# Altium project capstone_v1.1.PrjPcb
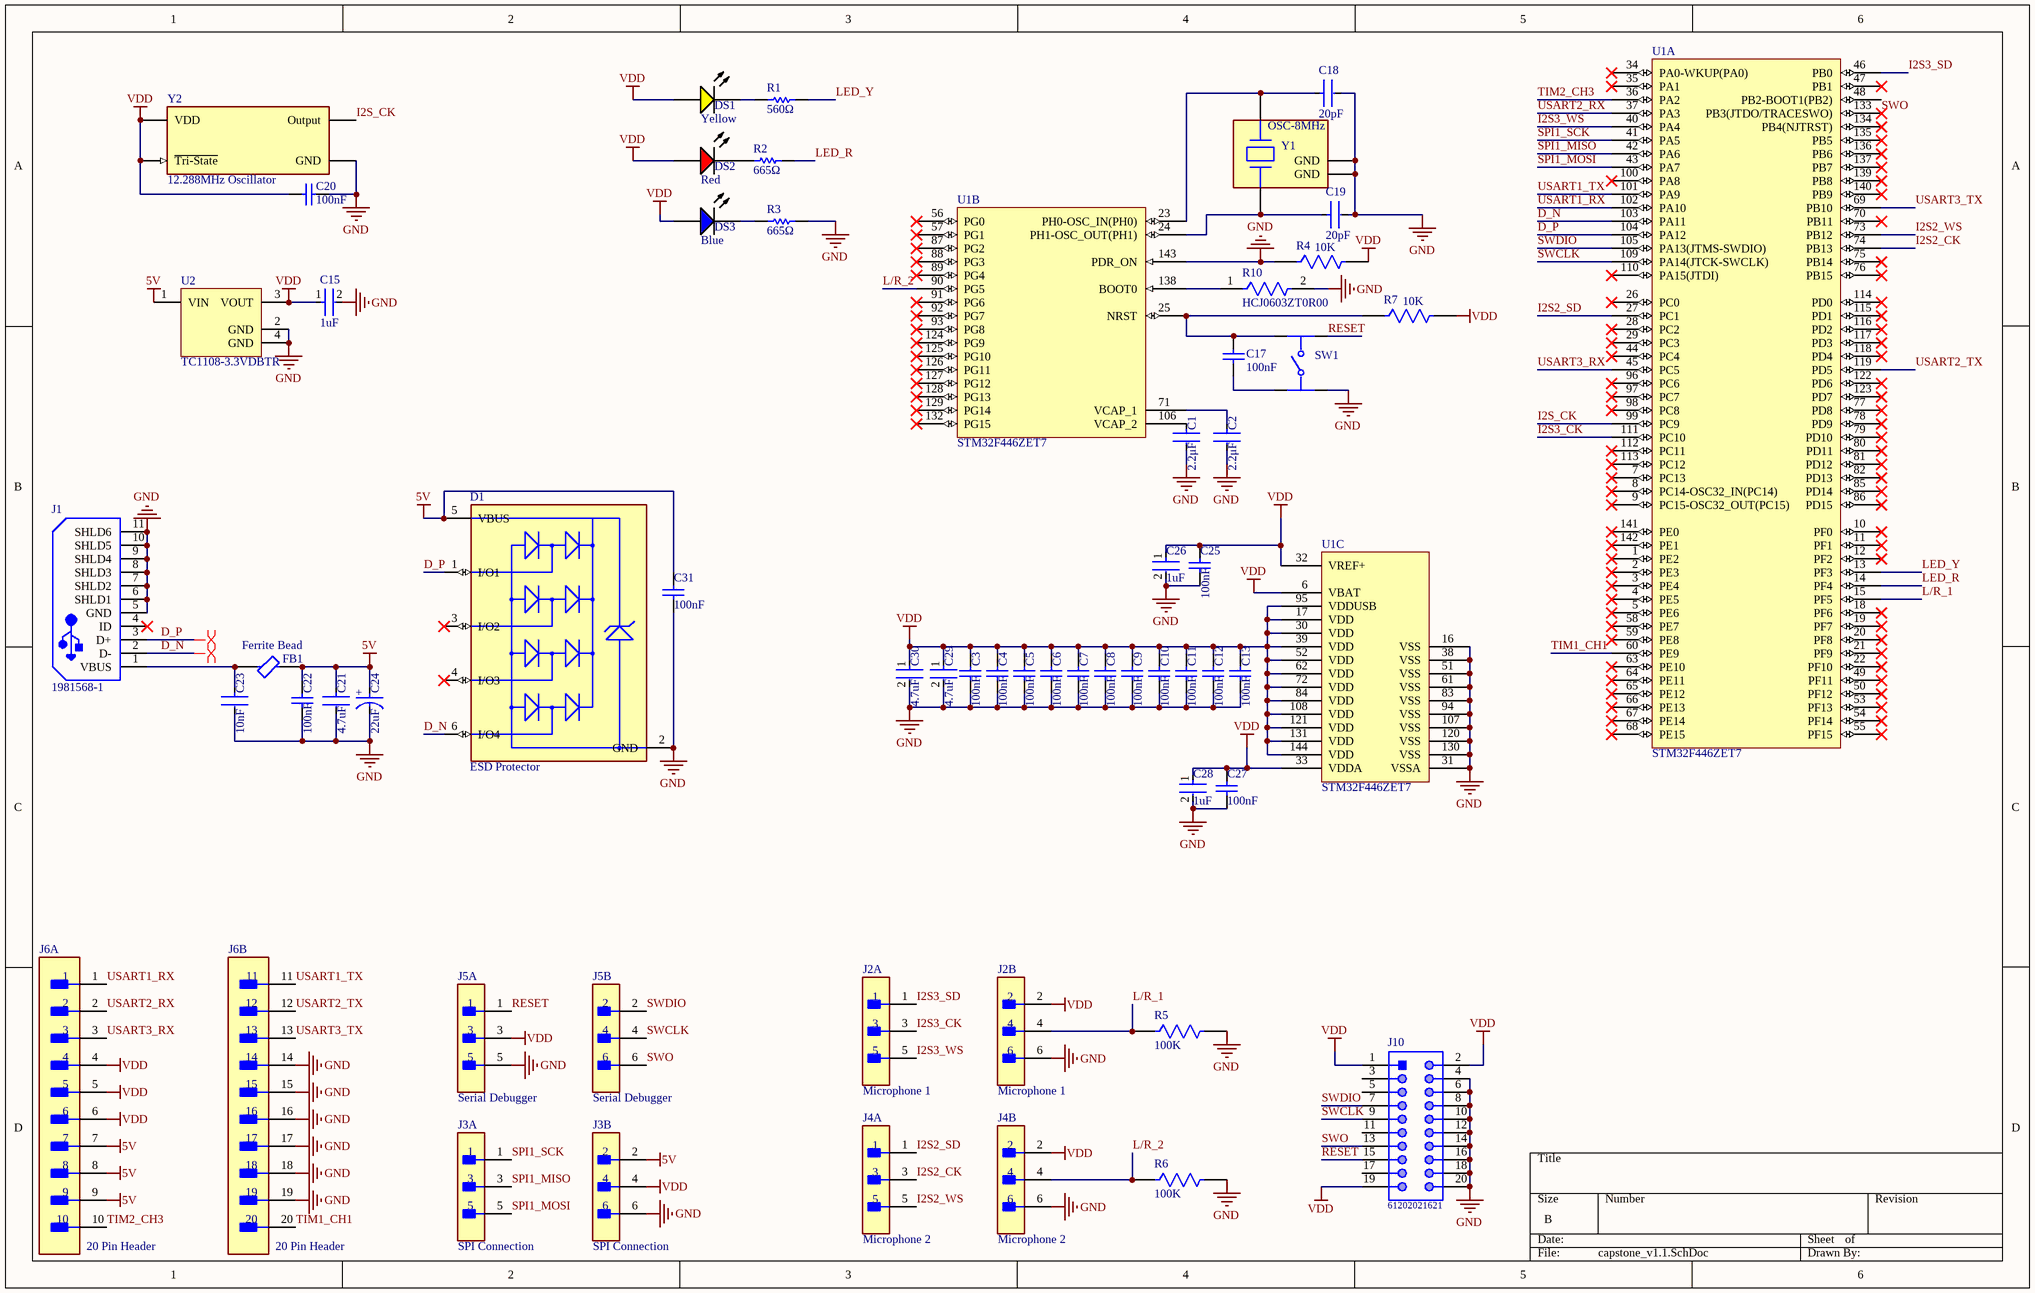
[diagram p0: capstone_v1.1.SchDoc]
1 sheet, 54 parts. Net scope: global (net labels, ports and power ports of the same name join across sheets).
Board file: PCB1.PcbDoc

## Sheet capstone_v1.1.SchDoc
size B; SheetNumber: 1; SheetTotal: 1

### Parts
C1  2.2μF  [FP-C1608-080-0_1-MFG]
C2  2.2μF  [FP-C1608-080-0_1-MFG]
C3  100nF  [SAMS-C0603-2_M]
C4  100nF  [SAMS-C0603-2_M]
C5  100nF  [SAMS-C0603-2_M]
C6  100nF  [SAMS-C0603-2_M]
C7  100nF  [SAMS-C0603-2_M]
C8  100nF  [SAMS-C0603-2_M]
C9  100nF  [SAMS-C0603-2_M]
C10  100nF  [SAMS-C0603-2_M]
C11  100nF  [SAMS-C0603-2_M]
C12  100nF  [SAMS-C0603-2_M]
C13  100nF  [SAMS-C0603-2_M]
C15  1uF  [FP-0603-L_1_6_0_15-W_0_81-IPC_A]
C17  100nF  [SAMS-C0603-2_M]
C18  20pF  [FP-C0603C-CF-MFG]
C19  20pF  [FP-C0603C-CF-MFG]
C20  100nF  [SAMS-C0603-2_M]
C21  4.7uF  [FP-C0603-CG-MFG]
C22  100nF  [SAMS-C0603-2_M]
C23  10nF  [FP-0603-L_1_6_0_15-W_0_81-MFG]
C24  22uF  [FP-T491C226K010AT-MFG]
C25  100nF  [SAMS-C0603-2_M]
C26  1uF  [FP-0603-L_1_6_0_15-W_0_81-IPC_A]
C27  100nF  [SAMS-C0603-2_M]
C28  1uF  [FP-0603-L_1_6_0_15-W_0_81-IPC_A]
C29  4.7uF  [FP-C0603-CG-MFG]
C30  4.7uF  [FP-C0603-CG-MFG]
C31  100nF  [SAMS-C0603-2_M]
D1  ESD Protector  [FP-SOT23-6L-MFG]
DS1  Yellow  [VISH-TLMY1000_V]
DS2  Red  [AVAG-HSMX-C190_V]
DS3  Blue  [AVAG-HSMX-C190_V]
FB1  Ferrite Bead  [FP-BLM15-0_05-IPC_A]
J1  1981568-1  [TECO-1981568-5_V]
J2  Microphone 1  [FP-M20-9980346-MFG]  (parts A,B of 2)
J3  SPI Connection  [FP-M20-9980346-MFG]  (parts A,B of 2)
J4  Microphone 2  [FP-M20-9980346-MFG]  (parts A,B of 2)
J5  Serial Debugger  [FP-M20-9980346-MFG]  (parts A,B of 2)
J6  20 Pin Header  [FP-TSW-110-08-G-D-MFG]  (parts A,B of 2)
J10  61202021621  [61202021621]
R1  560Ω  [RESC1608X55X30ML15T15]
R2  665Ω  [RESC1608X55X30ML15T15]
R3  665Ω  [RESC1608X55X30ML15T15]
R4  10K  [FP-MCT0603-IPC_C]
R5  100K  [FP-RC0603-0_55-MFG]
R6  100K  [FP-RC0603-0_55-MFG]
R7  10K  [FP-MCT0603-IPC_C]
R10  HCJ0603ZT0R00  [FP-HCJ0603-MFG]
SW1  PTS645SM43SMTR92LFS  [FP-PTS645SM43SMTR92LFS-MFG]  (value not drawn)
U1  STM32F446ZET7  [STM-LQFP144_M]  (parts A,B,C of 3)
U2  TC1108-3.3VDBTR  [SOT-223-DB3_L]
Y1  OSC-8MHz  [FP-ABM3B-MFG]
Y2  12.288MHz Oscillator  [FP-ASFL1-MFG]

### Nets
5V: C21.1 C22.2 C24.2(A) C31.2 D1.5(VBUS) FB1.2 J3.2 J6.7 J6.8 J6.9 U2.1(VIN)
GND: C1.1 C2.1 C3.1 C4.1 C5.1 C6.1 C7.1 C8.1 C9.1 C10.1 C11.1 C12.1 C13.1 C15.2 C18.2 C19.2 C20.1 C21.2 C22.1 C23.2 C24.1(C) C25.1 C26.2 C27.1 C28.2 C29.2 C30.2 C31.1 D1.2(GND) J1.5(GND) J1.6(SHLD1) J1.7(SHLD2) J1.8(SHLD3) J1.9(SHLD4) J1.10(SHLD5) J1.11(SHLD6) J2.6 J3.6 J4.6 J5.5 J6.14 J6.15 J6.16 J6.17 J6.18 J6.19 J10.4 J10.6 J10.8 J10.10 J10.12 J10.14 J10.16 J10.18 J10.20 R3.2 R4.1 R5.2 R6.2 R10.2 SW1.4 U1.16(VSS) U1.31(VSSA) U1.38(VSS) U1.51(VSS) U1.61(VSS) U1.83(VSS) U1.94(VSS) U1.107(VSS) U1.120(VSS) U1.130(VSS) U1.143(PDR_ON) U2.2(GND) U2.4(GND) Y1.2(GND) Y1.4(GND) Y2.2(GND)
VDD: C3.2 C4.2 C5.2 C6.2 C7.2 C8.2 C9.2 C10.2 C11.2 C12.2 C13.2 C15.1 C20.2 C25.2 C26.1 C27.2 C28.1 C29.1 C30.1 DS1.1(A) DS2.1(A) DS3.1(A) J2.2 J3.4 J4.2 J5.3 J6.4 J6.5 J6.6 J10.1 J10.2 J10.19 R4.2 R7.2 U1.6(VBAT) U1.17(VDD) U1.30(VDD) U1.32(VREF+) U1.33(VDDA) U1.39(VDD) U1.52(VDD) U1.62(VDD) U1.72(VDD) U1.84(VDD) U1.95(VDDUSB) U1.108(VDD) U1.121(VDD) U1.131(VDD) U1.144(VDD) U2.3(VOUT) Y2.1(~{Tri-State}) Y2.4(VDD)
D_N: D1.6(I/O4) J1.2(D-) U1.103(PA11)
D_P: D1.1(I/O1) J1.3(D+) U1.104(PA12)
I2S2_CK: J4.3 U1.74(PB13)
I2S2_SD: J4.1 U1.27(PC1)
I2S2_WS: J4.5 U1.73(PB12)
I2S3_CK: J2.3 U1.111(PC10)
I2S3_SD: J2.1 U1.46(PB0)
I2S3_WS: J2.5 U1.40(PA4)
I2S_CK: U1.99(PC9) Y2.3(Output)
L/R_1: J2.4 R5.1 U1.15(PF5)
L/R_2: J4.4 R6.1 U1.90(PG5)
LED_R: R2.2 U1.14(PF4)
LED_Y: R1.2 U1.13(PF3)
RESET: J5.1 J10.15 SW1.2
SPI1_MISO: J3.3 U1.42(PA6)
SPI1_MOSI: J3.5 U1.43(PA7)
SPI1_SCK: J3.1 U1.41(PA5)
SWCLK: J5.4 J10.9 U1.109(PA14(JTCK-SWCLK))
SWDIO: J5.2 J10.7 U1.105(PA13(JTMS-SWDIO))
SWO: J5.6 J10.13 U1.133(PB3(JTDO/TRACESWO))
TIM1_CH1: J6.20 U1.60(PE9)
TIM2_CH3: J6.10 U1.36(PA2)
USART1_RX: J6.1 U1.102(PA10)
USART1_TX: J6.11 U1.101(PA9)
USART2_RX: J6.2 U1.37(PA3)
USART2_TX: J6.12 U1.119(PD5)
USART3_RX: J6.3 U1.45(PC5)
USART3_TX: J6.13 U1.69(PB10)
NetC1_2: C1.2 U1.106(VCAP_2)
NetC2_2: C2.2 U1.71(VCAP_1)
NetC17_1: C17.1 SW1.3
NetC17_2: C17.2 R7.1 SW1.1 U1.25(NRST)
NetC18_1: C18.1 U1.23(PH0-OSC_IN(PH0)) Y1.1
NetC19_1: C19.1 U1.24(PH1-OSC_OUT(PH1)) Y1.3
NetC23_1: C23.1 FB1.1 J1.1(VBUS)
NetDS1_2: DS1.2(K) R1.1
NetDS2_2: DS2.2(K) R2.1
NetDS3_2: DS3.2(K) R3.1
NetR10_1: R10.1 U1.138(BOOT0)

Not connected (* = marked no-connect by the designer): D1 3(I/O2)* 4(I/O3)*; J1 4(ID)*; J10 3 5 11 17; U1 1(PE2)* 2(PE3)* 3(PE4)* 4(PE5)* 5(PE6)* 7(PC13)* 8(PC14-OSC32_IN(PC14))* 9(PC15-OSC32_OUT(PC15))* 10(PF0)* 11(PF1)* 12(PF2)* 18(PF6)* 19(PF7)* 20(PF8)* 21(PF9)* 22(PF10)* 26(PC0)* 28(PC2)* 29(PC3)* 34(PA0-WKUP(PA0))* 35(PA1)* 44(PC4)* 47(PB1)* 48(PB2-BOOT1(PB2)) 49(PF11)* 50(PF12)* 53(PF13)* 54(PF14)* 55(PF15)* 56(PG0)* 57(PG1)* 58(PE7)* 59(PE8)* 63(PE10)* 64(PE11)* 65(PE12)* 66(PE13)* 67(PE14)* 68(PE15)* 70(PB11)* 75(PB14)* 76(PB15)* 77(PD8)* 78(PD9)* 79(PD10)* 80(PD11)* 81(PD12)* 82(PD13)* 85(PD14)* 86(PD15)* 87(PG2)* 88(PG3)* 89(PG4)* 91(PG6)* 92(PG7)* 93(PG8)* 96(PC6)* 97(PC7)* 98(PC8)* 100(PA8)* 110(PA15(JTDI))* 112(PC11)* 113(PC12)* 114(PD0)* 115(PD1)* 116(PD2)* 117(PD3)* 118(PD4)* 122(PD6)* 123(PD7)* 124(PG9)* 125(PG10)* 126(PG11)* 127(PG12)* 128(PG13)* 129(PG14)* 132(PG15)* 134(PB4(NJTRST))* 135(PB5)* 136(PB6)* 137(PB7)* 139(PB8)* 140(PB9)* 141(PE0)* 142(PE1)*

### Layout directives
differential pair: D_N, D_P

### Notes on the sheet
- (in symbol CMP-03017-000041-1) +

### Library data of the parts
C1 C2 = CMP-08246-004960-1: Multilayer Ceramic Capacitors 2.2μF ±10% 35V X5R SMD 0603 / C1608X5R1V225K080AC; Capacitance: 2.2uF; Dielectric Material: Ceramic; Length: 1.6mm; Height: 0.8mm; Package Quantity: 1; Width: 0.031inch; Radiation Hardening: No; Lead Free: Lead Free; Mount: Surface Mount; REACH SVHC: No SVHC; Construction: Flat; Voltage Rating (DC): 35V; Voltage Rating: 35V; Case/Package: 0603; Termination: SMD/SMT; Dielectric: X5R; Resistor Type: Ceramic; Thickness: 800um; Tolerance: 10%; Case Code (Metric): 1608; Case Code (Imperial): 0603; Weight: 7.1E-05oz; RoHS Compliant: Yes; Min Operating Temperature: -55°C; Series: C; Max Operating Temperature: 85°C; Depth: 0.8mm; Voltage: 35V; Packaging: Tape and Reel
C3-C13 C17 C20 C22 C25 C27 C31 = CMP-2000-05332-1: Multi-layer Ceramic Capacitor, -55 to 125 degC, 2-Pin SMD (0603), RoHS, Tape and Reel / CL10B104KB8NNNC; Manufacturer: Samsung Electro-Mechanics; Capacitance: 0.1µF; Rated Voltage: 50V; Dielectric: X7R; Tolerance (%): ±10%; Case Size/Dimension: 0603; Datasheet URL: https://datasheet.ciiva.com/29198/456651-da-01-en-vs-kondensator-0605-29198839.pdf; Manufacturer URL: http://www.samsungsem.com/global/index.jsp; Datasheet Version: Nov-10
C15 C26 C28 = CMP-2006-04559-3: General Purpose Ceramic Capacitor, 0603, 1uF, 10%, X5R, 15%, 10V / 0603ZD105KAT2A; Insulation Resistance: 100GR; Dissipation Factor: 5%; Packaging: Tape and Reel; RoHS Compliant: Yes; Height: 0.9mm; Tolerance: 10%; Length: 1.6mm; Depth: 0.81mm; Case/Package: 0603; Max Operating Temperature: 85°C; Series: -; Dielectric: X5R; Construction: Flat; Capacitance: 1uF; REACH SVHC: No SVHC; Voltage Rating: 10V; Number of Pins: 2; Radiation Hardening: No; Case Code (Imperial): 0603; Min Operating Temperature: -55°C; Termination: SMD/SMT; Contact Plating: Tin; Voltage: 10V; Thickness: 0.035inch; Lead Free: Lead Free; Mount: Surface Mount; Width: 0.81mm; Voltage Rating (DC): 10V; Package Quantity: 4000; Case Code (Metric): 1608
C18 C19 = CMP-1035-00783-3: CAP CER 20PF 50V 5% NP0 0603 / C0603C200J5GACTU; Manufacturer: KEMET; Temperature Coefficient: 30ppm/°C; Temperature Characteristic: C0G; Automotive Grade: Grade 1; Tolerance: 0.05; Material: Ceramic; Category: Cap; Manufacturer Part Number: C0603C200J5GACTU; Temperature Range Low: -55°C; RoHS: TRUE; ComponentLink2URL: https://api.kemet.com/component-edge/download/datasheet/C0603C100J5GACAUTO.pdf; Package: C0603C-CF; Height: 0.87mm; Capacitance: 20 pF; Voltage Rating: 50 V; Octopart: https://octopart.com/c0603c200j5gactu-kemet-9138585; Device Class L1: Passive Components; Automotive: Yes; Digikey Description: CAP CER 20PF 50V 5% NP0 0603; Temperature Range High: +125°C; Device Class L3: Ceramic Capacitors; Mouser Description: Multilayer Ceramic Capacitors MLCC - SMD/SMT 50volts 20pF C0G 5%; ComponentLink2Description: Datasheet; Device Class L2: Capacitors; Lead Free: Yes; Temperature: -55°C to +125°C; Value: 20 pF
C21 C29 C30 = CMP-2006-02256-2: CAP CER 4.7UF 6.3V X5R 0603 / C0603C475K9PACTU; Manufacturer: Kemet; Temperature Coefficient: 15%; Tolerance: 10%; Material: Ceramic; Device Class L3: Ceramic Capacitors; RoHS: TRUE; Value: 4.7uF; Lead Free: Yes; ComponentLink2Description: Datasheet; Mouser Description: Multilayer Ceramic Capacitors MLCC - SMD/SMT 6.3volts 4.7uF X5R 10%; Package: C0603-CG; Digikey Description: CAP CER 4.7UF 6.3V X5R 0603; ComponentLink2URL: https://content.kemet.com/datasheets/KEM_C1006_X5R_SMD.pdf; Category: Cap; Temperature Range Low: -55°C; Capacitance: 4.7uF; Temperature: -55°C to +85°C; Octopart: https://octopart.com/c0603c475k9pactu-kemet-104242; Ipc Land Pattern Name: CAPC16080X80; Voltage Rating: 6.3V; Temperature Range High: +85°C; Height: 0.9mm; Temperature Characteristic: X5R; Device Class L1: Passive Components; Manufacturer Part Number: C0603C475K9PACTU; Automotive: No; Device Class L2: Capacitors
C23 = CMP-2006-04374-2: General Purpose Ceramic Capacitor, 0603, 10nF, 10%, X7R, 15%, 50V; Insulation Resistance: 100GR; Dissipation Factor: 2.5%; Voltage: 50V; Number of Pins: 2; Min Operating Temperature: -55°C; Mount: Surface Mount; Capacitance: 10nF; Width: 0.032inch; Height: 0.9mm; Voltage Rating: 50V; Termination: SMD/SMT; Package Quantity: 1; Dielectric: X7R; Max Operating Temperature: 125°C; Contact Plating: Tin; Length: 1.6mm; Dielectric Material: Ceramic; REACH SVHC: No SVHC; Case Code (Imperial): 0603; Depth: 0.81mm; Thickness: 0.035inch; Packaging: Tape and Reel; Tolerance: 10%; Lead Free: Lead Free; Voltage Rating (DC): 50V; Radiation Hardening: No; Case/Package: 0603; Case Code (Metric): 1608
C24 = CMP-03017-000041-1: CAP TANT 22UF 10% 10V 2312 / T491C226K010AT; Polarity: Polar; Leakage Current: 2.2uA; Tolerance: 20%; Life (Hours): 2000Hour; Dissipation Factor: 6%; ESR (Equivalent Series Resistance): 1.8R; Dielectric Material: Tantalum; Packaging: Tape and Reel; Termination: SMD/SMT; Length: 6mm; Voltage Rating (DC): 10V; Series: T491; Case/Package: Molded; Lead Free: Lead Free; Mount: Surface Mount; RoHS Compliant: Yes; Number of Pins: 2; Voltage Rating: 10V; Case Code (Imperial): 2312; Width: 3.2mm; Case Code (Metric): 6032; Voltage: 10V; Depth: 3.2mm; Features: General Purpose; Height - Seated (Max): 0.11inch; Capacitance: 22uF; Size: 2.5mm; Max Operating Temperature: 125°C; Construction: Flat; REACH SVHC: No SVHC; Package Quantity: 1; Min Operating Temperature: -55°C; Radiation Hardening: No; Height: 2.5mm
D1 = CMP-2000-07370-2: TVS DIODE 5.25V 17V SOT23-6 / USBLC6-4SC6; Manufacturer: STMicroelectronics; Peak Pulse Power: 130W; Breakdown Voltage: 6V; Value: 3pF; Direction: Unidirectional; Interface: USB,Ethernet,Other; Number Of Channels: 4; Standoff Height: 0mm; Max Junction Temp: +125°C; Digikey Description: TVS DIODE 5.25V 17V SOT23-6; Automotive: No; Package: SOT23-6L; Mouser Description: USBLC6 Series 4 Line 6 V Uni / Bi-Directional ESD Protection - SOT-23-6; Octopart: https://octopart.com/usblc6-4sc6-stmicroelectronics-347147; RoHS: TRUE; ComponentLink2URL: https://upverter.com/datasheet/23dc4ffb028d868909e80577610284b194f13213.pdf; ComponentLink2Description: Datasheet; Device Class L1: Circuit Protection; Lead Free: Yes; Temperature Range High: +125°C; Device Class L2: ESD and Circuit Protection ICs; Device Class L3: unset; Capacitance: 3pF; Height: 1.45mm; Temperature Range Low: -40°C; Manufacturer Part Number: USBLC6-4SC6; Temperature: -40°C to +125°C; Category: Diode; Clamping Voltage: 17V
DS1 = CMP-2000-07255-1: Low Current LED, 40 mW, -40 to 100 degC, 2-Pin SMD, RoHS, Tape and Reel / TLMY1000-GS08; Manufacturer: Vishay; Wavelength Typ: 595nm; Forward Current If: 2mA; Viewing Angle: 80°; Bulb Size: 1.6mmx0.8mm; Forward Voltage: 1.8V; Luminous Intensity: 7.5mcd; SVHC: ToBeAdvised; Automotive Qualification Standard: AEC-Q100; Lens Shape: Rectangular; LED Mounting: SMD; Mounting Technology: SurfaceMount; Packaging: CutTape; MSL: MSL2-1year; Datasheet URL: http://www.vishay.com/docs/83172/tlmo1000.pdf; Package Reference: TLMY1000; Manufacturer URL: http://www.vishay.com/; Package Description: 2-Pin Surface Mount Device, Body 1.6 x 0.8 mm; LED Colour: Yellow; Datasheet Version: Rev. 2.0, 09/2013; Product Range: -
DS2 = CMP-1744-00004-1: LED Uni-Color Red, 65 mW, 20 mA, -40 to 85 degC, 2-Pin SMD, RoHS, Tape and Reel / HSMH-C190; Connector Type: USB; Gender: Male; Current Rating: 1 A; Length: 7.5 mm; Lead Pitch: 0.65 mm; PackageReference: HSMX-C190; Package Quantity: 2000; Max Operating Temperature: 85 degC; PackageDescription: 2-Pin Surface Mount Device, Body 1.6 x 0.8 mm, Height 0.9 mm; ComponentLink3Description: Package Specification; Mount: Surface Mount; Min Operating Temperature: -30 degC; ComponentLink3URL: http://www.fairchildsemi.com/dwg/MA/MA03D.pdf; ComponentLink1Description: Manufacturer URL; Contact Material: Copper; Pins: 5; Width: 5.6 mm; ComponentLink2Description: Datasheet; RoHSCompliant: true; DatasheetVersion: Mar-12; Height: 2.8 mm; Packaging: Tape and Reel; Contact Plating: Gold; ComponentLink1URL: http://www.avagotech.com/; REACH SVHC: No SVHC; ComponentLink2URL: http://docs.avagotech.com/docs/AV02-0551EN
DS3 = CMP-1744-00007-1: LED Uni-Color Blue, 78 mW, 20 mA, -40 to 85 degC, 2-Pin SMD, RoHS, Tape and Reel / HSMR-C190; Rds On Max: 10 Ohm; Nominal Vgs: -1.7 V; Max Power Dissipation: 360 mW; Elements: 1; Case\Package: TO-236-3; Input Capacitance: 73 pF; Typical Rise Time: 6.3 ns; Nominal Dual Supply Voltage: -50 V; Packaging: Tape and Reel; Height: 0.93 mm; Mount: Surface Mount; RoHSCompliant: true; DatasheetVersion: Apr-10; REACH SVHC: No SVHC; ComponentLink1URL: http://www.avagotech.com/; Radiation Hardening: No; ComponentLink3Description: Package Specification; ComponentLink3URL: http://www.fairchildsemi.com/dwg/MA/MA03D.pdf; ComponentLink2Description: Datasheet; PackageDescription: 2-Pin Surface Mount Device, Body 1.6 x 0.8 mm, Height 0.9 mm; Package Quantity: 3000; PackageReference: HSMX-C190; ComponentLink1Description: Manufacturer URL; Pins: 3; Length: 2.92 mm; ComponentLink2URL: http://docs.avagotech.com/docs/AV02-0977EN; Min Operating Temperature: -55 degC; Width: 1.3 mm; Max Operating Temperature: 150 degC
FB1 = CMP-0686-00269-4: Chip Ferrite Bead, 0402, 220Ω @ 100MHz, 0.1Ω, 25%, 1.4A / BLM15PX221SN1D; DC Resistance (DCR): 100mR; Material: Steel; Number of Circuits: 1; Impedance: 220R; Lead Free: Lead Free; Packaging: Tape and Reel; Test Frequency: 100MHz; Current Rating: 1.4A; Length: 1mm; Package Quantity: 1; Termination: SMD/SMT; RoHS Compliant: Yes; Max Current Rating: 1.4A; Case/Package: 0402; Number of Pins: 2; Max Operating Temperature: 125°C; Series: BLM15PX; Width: 0.5mm; Case Code (Metric): 1005; Height: 0.5mm; Case Code (Imperial): 0402; Max DC Current: 1.4A; Tolerance: 25%; Number of Lines: 1; Min Operating Temperature: -55°C
J1 = CMP-2000-05408-1: Micro USB Receptacle Standard Type B Assy, 5-Pin SMD, RoHS, Tape and Reel; Manufacturer: TE Connectivity; Body Orientation: RightAngle; Number of Ports: 1Port; Number of Contacts: 5POS; Gender: RCP; Voltage Rating Max: 30VAC; Product Depth (mm): 5.6mm; Pitch (mm): 0.65mm; Current Rating (Max): 1/ContactA; Product Length (mm): 8mm; Product Height (mm): 3mm; Operating Temperature Max Deg. C: 85C; Datasheet URL: http://www.mouser.com/ds/2/418/NG_CD_1981568_E2-621296.pdf; Termination Method: Solder; Number of Terminals: 5; Operating Temp Range: -55Cto85C; Mounting Style: SurfaceMount; Manufacturer URL: http://www.te.com/; Contact Material: CopperAlloy; Packaging: TapeandReel; Datasheet Version: Rev. E2, 08/2015; Operating Temperature Min Deg. C: -55C; Housing Material: Thermoplastic; Type: MicroUSB; Contact Plating: GoldOverNickel
J2-J5 = CMP-2000-06636-2: CONN HEADER VERT 6POS 2.54MM / M20-9980346; Manufacturer: Harwin; Current Rating: 3A; Number Of Contacts: 6; Conn Gender: Male; Conn Orientation: Vertical; Device Class L1: Connectors; ComponentLink2Description: Datasheet; Height: 8.99mm; Temperature Range High: +105°C; Contact Material: Tin,Nickel; RoHS: TRUE; Temperature Range Low: -40°C; ComponentLink2URL: https://cdn.harwin.com/pdfs/M20-998.pdf; Digikey Description: CONN HEADER VERT 6POS 2.54MM; Pitch: 2.54mm; Package: M20-9980346; Device Class L2: Headers and Wire Housings; Manufacturer Part Number: M20-9980346; Number Of Rows: 2; Category: Conn; Lead Free: Yes; Mouser Description: 2.54mm (0.1") Pitch DIL Vertical PC Tail Pin Header, 6.1mm mating pin height, tin, 3+3 contacts; Temperature: -40°C to +105°C; Device Class L3: unset; Octopart: https://octopart.com/m20-9980346-harwin-5436545; Automotive: No
J6 = CMP-02766-000083-1: CONN HEADER VERT 20POS 2.54MM / TSW-110-08-G-D; Manufacturer: Samtec; Conn Gender: Male; Number Of Contacts: 20; Conn Orientation: Straight; Lead Free: Yes; Category: Conn; Manufacturer Part Number: TSW-110-08-G-D; Temperature Range High: +125°C; Pitch: 2.54mm; Temperature: -55°C to +125°C; Automotive: No; Device Class L1: Connectors; ComponentLink2URL: http://suddendocs.samtec.com/prints/tsw-xxx-xx-xxx-x-xx-xxx-mkt.pdf; Temperature Range Low: -55°C; ComponentLink2Description: Datasheet; Height: 8.71mm; Number Of Rows: 2; Digikey Description: CONN HEADER VERT 20POS 2.54MM; Package: TSW-110-08-G-D; Device Class L3: unset; Contact Material: Gold,Nickel; Octopart: https://octopart.com/tsw-110-08-g-d-samtec-272555; Footprint Url: http://suddendocs.samtec.com/prints/tsw-xxx-xx-x-x-xx-xxx-footprint.pdf; RoHS: TRUE; Ipc Land Pattern Name: CAPAD1016W80L630D240; Device Class L2: Headers and Wire Housings
J10 = CMP-1502-00010-1: Male Box Header WR-BHD, THT, Vertical, pitch 2.54 mm, 20 pins; Manufacturer: Wurth Elektronik; Contact Resistance: 20mOhm; Withstanding Voltage: 500VAC; Pitch: 2.54mm; Pin Number: 20; Working Voltage: 250VAC; Orientation: Vertical; Package Reference: 61202021621; Publisher: WurthElektronik; Datasheet URL: https://katalog.we-online.de/em/datasheet/6120xx21621.pdf; Operating Temperature: -40to125degC; Packaging: Tray; Part Number: 61202021621; Mounting Technology: THT; Gender: Male; Manufacturer URL: http://www.we-online.de; Published Date: August2018
R1 = CMP-2000-00564-2: Chip Resistor, 560 Ohm, +/- 1%, 0.1 W, -55 to 155 degC, 0603 (1608 Metric), RoHS, Tape and Reel / ERJ-3EKF5600V; Output Current: 2 A; Max Supply Voltage: 5 V; Min Supply Voltage: 3 V; Output Voltage: 35 V; Case\Package: QFN; Outputs: 1; PackageDescription: 2-Pin Surface Mount Device, Body 1.6 x 0.85 mm; ComponentLink1Description: Manufacturer URL; ComponentLink1URL: http://www.panasonic.com/; ComponentLink2Description: Datasheet; Package Quantity: 1500; DatasheetVersion: Apr-15; Min Operating Temperature: -20 degC; PackageReference: 0603; RoHSCompliant: true; Packaging: Tape and Reel; ComponentLink2URL: http://industrial.panasonic.com/cdbs/www-data/pdf/RDA0000/AOA0000C86.pdf; Radiation Hardening: No; REACH SVHC: No SVHC; Mount: Surface Mount; Max Operating Temperature: 85 degC; Pins: 28
R2 R3 = CMP-2000-00608-1: ERJ-3EKF6650V; Manufacturer: Panasonic; Part Number: ERJ-3EKF6650V
R4 R7 = CMP-02407-000418-1: RES SMD 100 OHM 1% 1/8W 0603 / MCT06030C1002FP500; Voltage Rating: 75V; Power Rating: 100mW; Temperature Coefficient: 50ppm/°C; Max Power Dissipation: 125mW; Resistance: 10kR; Case/Package: 0603; Military Standard: Not; Min Operating Temperature: -55°C; Width: 0.8mm; Package Quantity: 1; Max Operating Temperature: 125°C; Tolerance: 1%; Depth: 0.85mm; Radiation Hardening: No; Mount: Surface Mount; Composition: Thin Film; Contact Plating: Tin; Lead Free: Lead Free; Case Code (Imperial): 0603; Number of Terminations: 2; Voltage Rating (DC): 75V; Length: 1.55mm; Packaging: Tape and Reel; Height: 0.022inch; Case Code (Metric): 1608
R5 R6 = CMP-2100-03662-2: RES SMD 100K OHM 1% 1/10W 0603 / RC0603FR-07100KL; Voltage Rating (DC): 50V; Resistance: 100kR; Max Power Dissipation: 100mW; Temperature Coefficient: 100ppm/°C; Working Voltage: 75V; Length: 1.6mm; Lead Free: Lead Free; Number of Terminations: 2; Packaging: Tape and Reel; Voltage Rating: 50V; Termination: SMD/SMT; Width: 0.8mm; Resistor Type: Thick Film; Resistance Tolerance: 1%; Features: Moisture Resistant; Height: 0.45mm; Construction: Rectangular; Case/Package: 0603; Military Standard: Not; Case Code (Imperial): 0603; Series: RC; Technology: THICK FILM; Depth: 0.8mm; RoHS Compliant: Yes; REACH SVHC: No SVHC; Min Operating Temperature: -55°C; Case Code (Metric): 1608; Max Operating Temperature: 155°C; Power Rating: 100mW; Number of Pins: 2; Tolerance: 1%
R10 = CMP-26527-000122-1: RES 0 OHM JUMPER 1/4W 0603; Resistance: 0mR; Termination: Wraparound; Mount: Surface Mount; Min Operating Temperature: -55°C; Number of Terminations: 2; Packaging: Tape and Reel; Case Code (Imperial): 0603; Height: 0.021inch; RoHS Compliant: Yes; Width: 0.031inch; Package Quantity: 5000; Max Operating Temperature: 155°C; Radiation Hardening: No; Case/Package: 0603; Length: 0.061inch; Case Code (Metric): 1608
SW1 = CMP-2000-05160-2: SWITCH TACTILE SPST-NO 0.05A 12V; Contact Resistance: 100mR; Throw Configuration: SPST; Illumination Type: Non-Illuminated; Mechanical Life: 100000Cycles; Current Rating: 50mA; Switch Function: Off-Mom; Actuator Length: 0.85mm; Actuator Material: Nylon; Actuator Type: Standard; Operating Force: 160gf; Min Operating Temperature: -20°C; REACH SVHC: No SVHC; Termination: Gull Wing; Case/Package: SMD/SMT; Packaging: Tape and Reel; Mount: Surface Mount; Voltage Rating (DC): 12V; Orientation: Straight; Lead Free: Lead Free; Contact Material: Silver; Color: Black; Max Current Rating: 50mA; Contact Plating: Silver; Depth: 9mm; Package Quantity: 1; Max Voltage Rating (DC): 12V; Length: 6mm; Max Operating Temperature: 60°C; ComponentLink1Description: Digikey; ComponentLink1URL: https://www.digikey.com/en/products/detail/PTS645SM43SMTR92%2520LFS/CKN9112TR-ND/1146840?utm_campaign=buynow&utm_medium=aggregator&curr=usd&utm_source=octopart
U1 = CMP-0243-00227-1: ARM Cortex-M4 32-bit MCU+FPU, 512 KB Flash, 128 KB Internal RAM, 114 I/Os, 144-Pin LQFP, -40 to 105 degC, Tray; Operating Frequency(F) (Processor speed) (MHz): 180; FLASH Size (Prog) (kB): 512; D/A Converter: 2; Internal RAM Size (kB): 128; I/Os (High Current): 114; Supply Voltage(Vcc) min (V): 1.7; Package Reference: 144-Pin Low Profile Quad Flat Package, Body 20 x 20 mm, Pitch 0.5 mm; Package Description: LQFP144; DatasheetVersion: Rev. 6; ComponentLink2Description: Datasheet; Mounting Technology: Surface Mount; Packing: Tray; ComponentLink2URL: http://www.st.com/st-web-ui/static/active/en/resource/technical/document/datasheet/DM00141306.pdf; Core: ARM Cortex-M4; ComponentLink1URL: http://www.st.com/; ComponentLink1Description: Manufacturer URL
U2 = CMP-0136-00450-1: 300mA CMOS LDO, 3-Pin SOT-223, Extended Temperature, Tape and Reel; PackageReference: SOT-223-DB3; PackageDescription: 3-Lead Plastic Small Outline Transistor (DB) [SOT-223]; PackageVersion: revBB, Aug-2009; DatasheetVersion: revB, 2002
Y1 = CMP-1688-00002-2: Crystal 8MHz ±20ppm 18pF SMD-4 5mm x 3.2mm / ABM3B-8.000MHZ-B2-T; ESR (Equivalent Series Resistance): 200R; Frequency Stability: 50ppm; Operating Frequency: 8 MHz; Mount: Surface Mount; Number of Pins: 4; Packaging: Tape and Reel; Width: 0.126inch; Case/Package: CSMD; Lead Free: Lead Free; Depth: 3.2mm; Load Capacitance: 18pF; Min Operating Temperature: -20°C; Series: ABM3B; Package Quantity: 1000; Resistor Type: Ceramic; Height: 0.043inch; Max Operating Temperature: 70°C; Frequency Tolerance: 20ppm; Series Resistance: 200R; Tolerance: 20ppm; Termination: SMD/SMT; Length: 5mm; Frequency: 8MHz; ComponentLink1Description: Digikey; ComponentLink1URL: https://www.digikey.com/en/products/detail/ABM3B-8.000MHZ-B2-T/535-9720-2-ND/1873166?utm_campaign=buynow&utm_medium=aggregator&curr=usd&utm_source=octopart
Y2 = CMP-27762-010926-1: XTAL Oscillator 12.288MHz ±50ppm HCMOS, TTL 3.3V 4-SMD 5mm x 3.2mm / ASFL1-12.288MHZ-EC-T; Min Supply Voltage: 2.97V; Max Supply Current: 15mA; Max Supply Voltage: 3.63V; Load Capacitance: 15pF; Frequency Stability: 50ppm; Series: ASFL1; Number of Pins: 4; Operating Supply Voltage: 3.3V; Frequency: 12.288MHz; Depth: 3.2mm; Width: 0.126inch; Packaging: Tape and Reel; Mount: Surface Mount; Lead Free: Lead Free; Height: 0.051inch; Case/Package: SMD/SMT; Min Operating Temperature: -20°C; Max Operating Temperature: 70°C; Termination: SMD/SMT; Radiation Hardening: No; Length: 5mm; Operating Frequency: 12.288 MHz